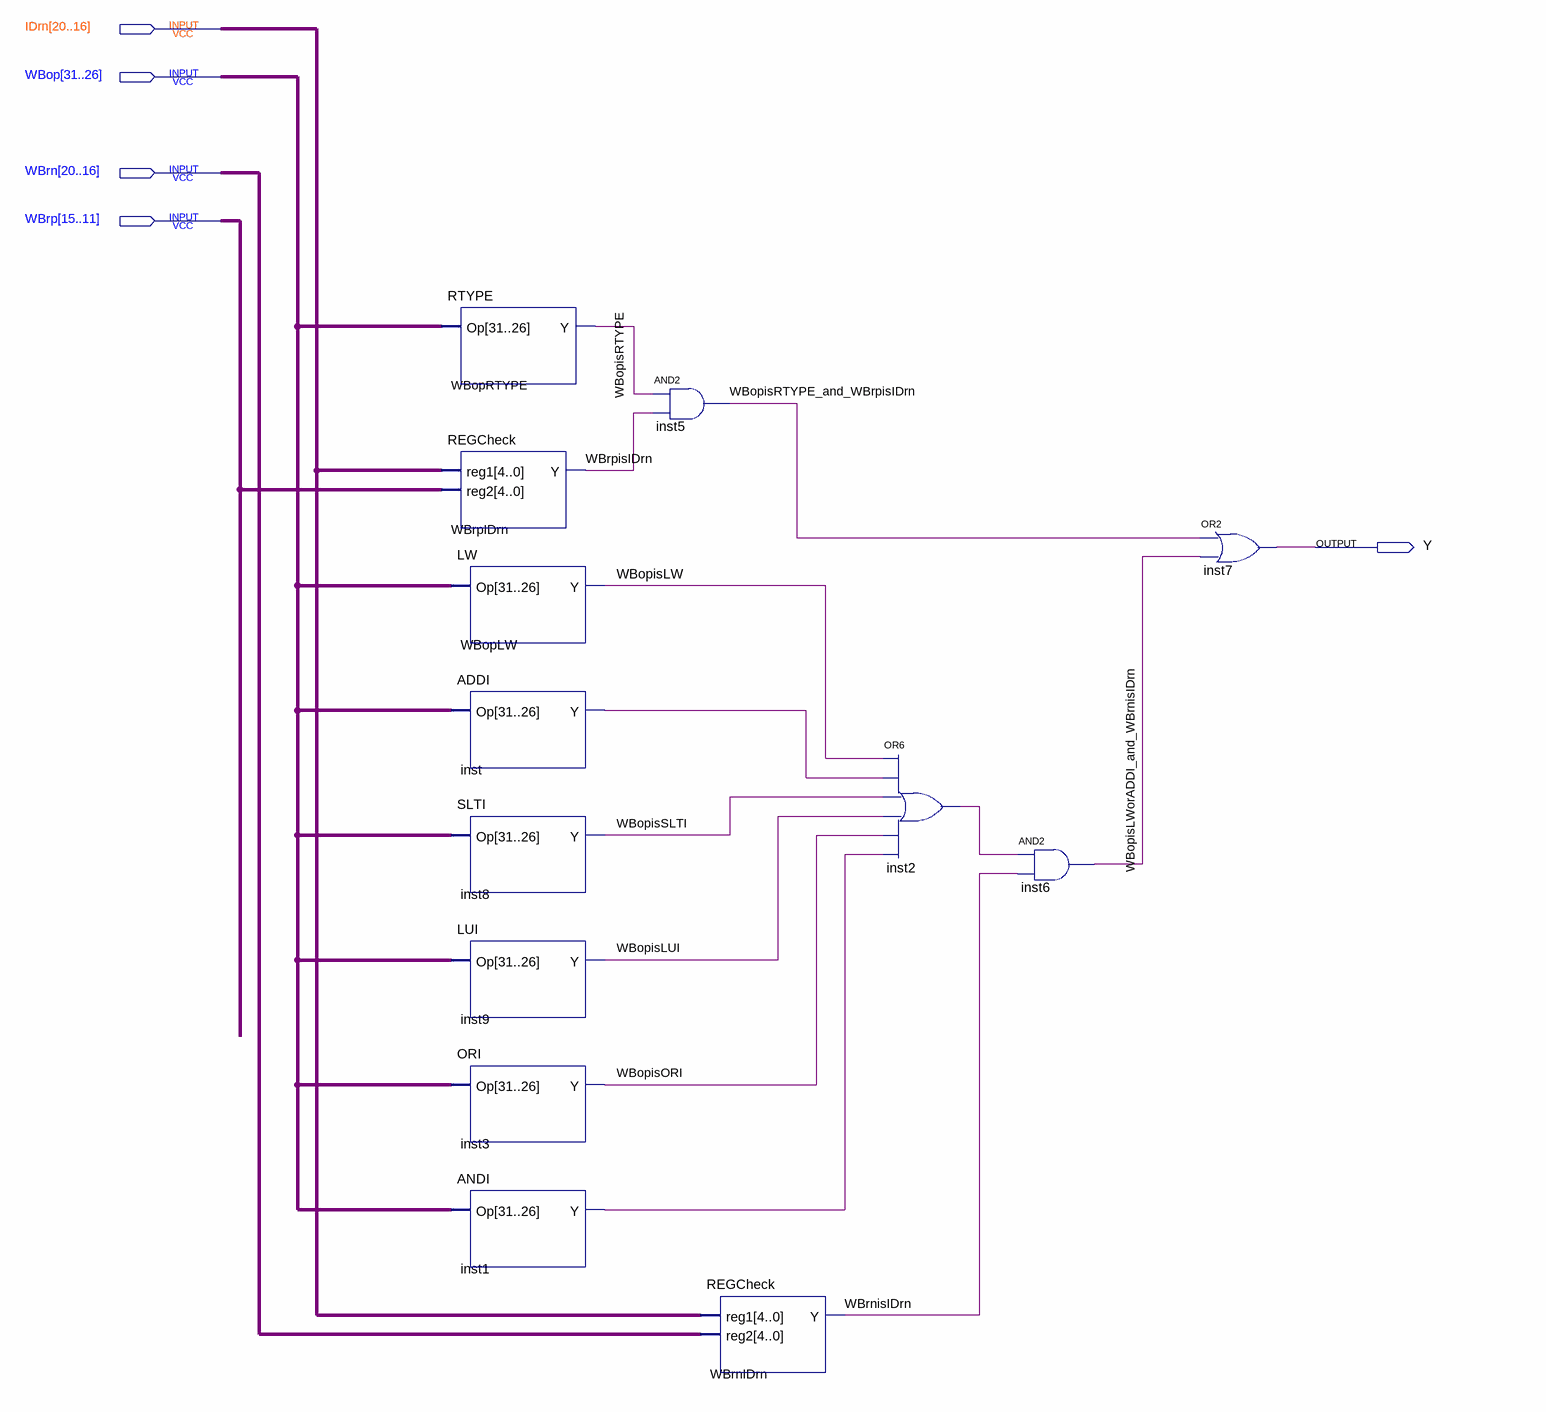
[diagram p0: schematic sheet]
// Quartus schematic ForwardBfromWBtoID.bdf as structural Verilog: 13 symbols, 5 pins
module ForwardBfromWBtoID (
  input  [20:16] IDrn,
  input  [31:26] WBop,
  input  [20:16] WBrn,
  input  [15:11] WBrp,
  output Y
);

  wire inst1_y, inst2_out, inst_y, WBopisLUI, WBopisLW, WBopisLWorADDI_and_WBrnisIDrn, WBopisORI,
       WBopisRTYPE, WBopisRTYPE_and_WBrpisIDrn, WBopisSLTI, WBrnisIDrn, WBrpisIDrn;

  RTYPE WBopRTYPE (.Op(WBop), .Y(WBopisRTYPE));
  REGCheck WBrpIDrn (.reg1(IDrn), .reg2(WBrp), .Y(WBrpisIDrn));
  LW WBopLW (.Op(WBop), .Y(WBopisLW));
  ADDI inst (.Op(WBop), .Y(inst_y));
  SLTI inst8 (.Op(WBop), .Y(WBopisSLTI));
  LUI inst9 (.Op(WBop), .Y(WBopisLUI));
  ORI inst3 (.Op(WBop), .Y(WBopisORI));
  ANDI inst1 (.Op(WBop), .Y(inst1_y));
  and inst5 (WBopisRTYPE_and_WBrpisIDrn, WBopisRTYPE, WBrpisIDrn);
  REGCheck WBrnIDrn (.reg1(IDrn), .reg2(WBrn), .Y(WBrnisIDrn));
  or inst2 (inst2_out, WBopisLW, inst_y, WBopisSLTI, WBopisLUI, WBopisORI, inst1_y);
  and inst6 (WBopisLWorADDI_and_WBrnisIDrn, inst2_out, WBrnisIDrn);
  or inst7 (Y, WBopisRTYPE_and_WBrpisIDrn, WBopisLWorADDI_and_WBrnisIDrn);
endmodule
